# Altium schematic sheet GSM IoT Block Diagram.SchDoc: GSM IoT Block Diagram
size 292 x 193 mm; SheetNumber: 1; SheetTotal: 10
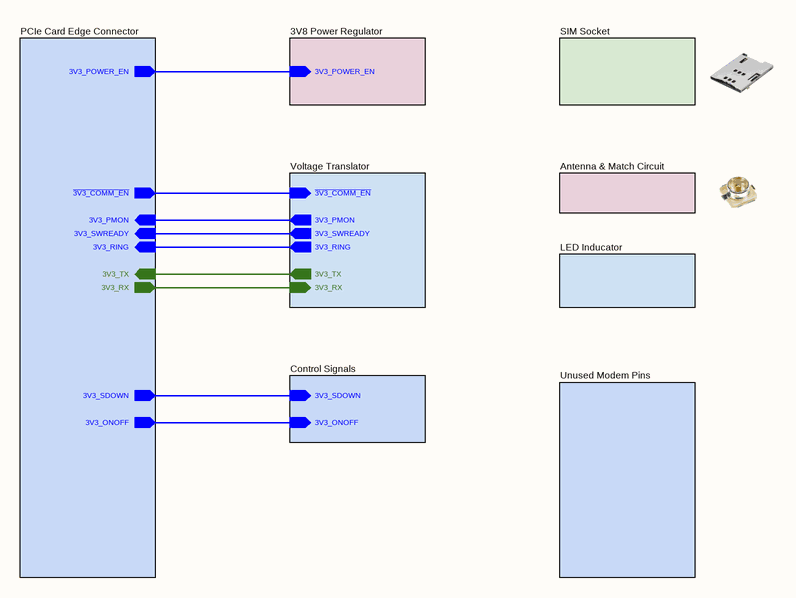
[diagram p0: GSM IoT Block Diagram.SchDoc]

## Sub-sheets
3V8 Power Regulator = 3V8_Power_Regulator.SchDoc: 3V3_POWER_EN (in)
Antenna & Match Circuit = Antenna.SchDoc: no entries
Control Signals = Control_Signals.SchDoc: 3V3_SDOWN (in), 3V3_ONOFF (in)
LED Inducator = Stat_LED_Driver.SchDoc: no entries
PCIe Card Edge Connector = Edge_Connector.SchDoc: 3V3_POWER_EN (out), ~{3V3_COMM_EN} (out), 3V3_ONOFF (out), 3V3_SDOWN (out), 3V3_PMON (in), 3V3_SWREADY (in), 3V3_RING (in), 3V3_TX (in), 3V3_RX (out)
SIM Socket = SIM_Socket.SchDoc: no entries
Unused Modem Pins = Unused_Modem_Pins.SchDoc: no entries
Voltage Translator = Voltage_Translator.SchDoc: ~{3V3_COMM_EN} (in), 3V3_PMON (out), 3V3_SWREADY (out), 3V3_RING (out), 3V3_TX (out), 3V3_RX (in)

## Nets
(unnamed): sheet Voltage Translator/~{3V3_COMM_EN}, sheet PCIe Card Edge Connector/~{3V3_COMM_EN}
(unnamed): sheet Voltage Translator/3V3_PMON, sheet PCIe Card Edge Connector/3V3_PMON
(unnamed): sheet Voltage Translator/3V3_SWREADY, sheet PCIe Card Edge Connector/3V3_SWREADY
(unnamed): sheet Voltage Translator/3V3_RING, sheet PCIe Card Edge Connector/3V3_RING
(unnamed): sheet Voltage Translator/3V3_TX, sheet PCIe Card Edge Connector/3V3_TX
(unnamed): sheet Voltage Translator/3V3_RX, sheet PCIe Card Edge Connector/3V3_RX
(unnamed): sheet 3V8 Power Regulator/3V3_POWER_EN, sheet PCIe Card Edge Connector/3V3_POWER_EN
(unnamed): sheet PCIe Card Edge Connector/3V3_ONOFF, sheet Control Signals/3V3_ONOFF
(unnamed): sheet PCIe Card Edge Connector/3V3_SDOWN, sheet Control Signals/3V3_SDOWN

## Notes on the sheet
- © 2026 All rights reserved.
  This document may not, in whole or in part, be copied, photocopied, reproduced, translated or converted to any electronic or machine readable from without prior written permission of Mehmet Günce Akkoyun.
  Engineer contact : akkoyun@me.com
- Property of
- Engineer :
- Date :
- Size :
- A4
- Time :
- Project :
- Page :
- /
- Customer :
- Product ID :
- Module ID :
- Version :
- File :
- Revision :